# EAGLE design IndividualTrilife_1_3 (EAGLE 6.2)
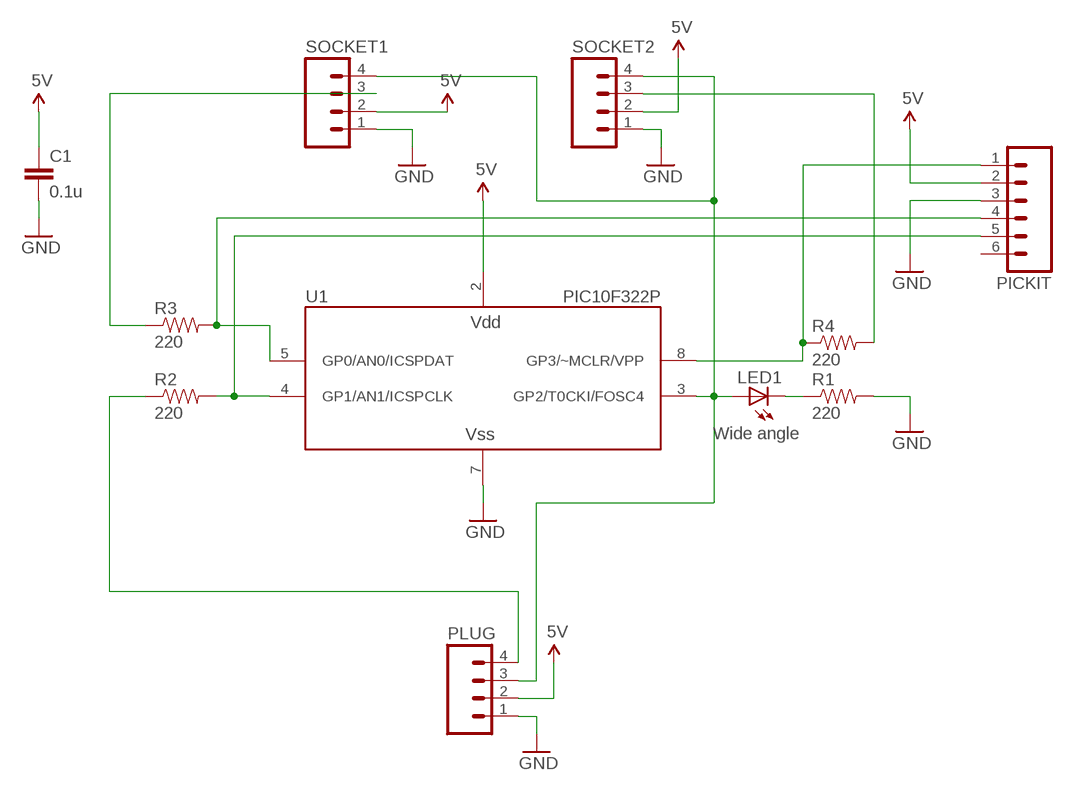
[diagram p0: schematic, sheet 1]

## Parts
C1  0.1u  CAPPTH  [CAP-PTH-SMALL]
LED1  Wide angle  LED5MM  [LED5MM]
PICKIT  M06LOCK  [1X06_LOCK]
PLUG  M04LOCK  [1X04_LOCK]
R1  220  RESISTORPTH-1/4W  [AXIAL-0.4]
R2  220  RESISTORPTH-1/4W  [AXIAL-0.4]
R3  220  RESISTORPTH-1/4W  [AXIAL-0.4]
R4  220  RESISTORPTH-1/4W  [AXIAL-0.4]
SOCKET1  M04LOCK  [1X04_LOCK]
SOCKET2  M04LOCK  [1X04_LOCK]
U1  PIC10F322P  [DIP-8]

## Nets
5V: C1.1 PICKIT.2 PLUG.2 SOCKET1.2 SOCKET2.2 U1.2(VDD)
GND: C1.2 PICKIT.3 PLUG.1 R1.P$2 SOCKET1.1 SOCKET2.1 U1.7(VSS)
N$1: LED1.A PLUG.3 SOCKET1.4 SOCKET2.4 U1.3(GP2/T0CKI/FOSC4)
N$2: LED1.K(C) R1.P$1
N$3: PICKIT.1 R4.P$1 U1.8(GP3/~MCLR/VPP)
N$4: PICKIT.4 R3.P$2 U1.5(GP0/AN0/ICSPDAT)
N$5: PICKIT.5 R2.P$2 U1.4(GP1/AN1/ICSPCLK)
N$6: R4.P$2 SOCKET2.3
N$8: R3.P$1 SOCKET1.3
N$9: PLUG.4 R2.P$1
Unconnected: PICKIT.6

## Library data of the parts
C1 = SparkFun:CAP: Capacitor Standard 0603 ceramic capacitor, and 0.1" leaded capacitor.
LED1 = SparkFun:LED: LEDs Standard schematic elements and footprints for 5mm, 3mm, 1206, and 0603 sized LEDs. 5mm - Spark Fun Electronics SKU : COM-00529 (and others)
PICKIT = SparkFun:M06: Header 6 Standard 6-pin 0.1" header. Use with straight break away headers (SKU : PRT-00116), right angle break away headers (PRT-00553), swiss pins (PRT-00743), machine pins (PRT-00117), and female headers (PRT-00115). Molex polarized connector foot print use with SKU : PRT-08094 with associated crimp pins and housings. NOTES ON THE VARIANTS LOCK and LOCK_LONGPADS... This footprint was designed to help hold the alignment of a through-hole component (i.e. 6-pin header) while soldering it into place. You may notice that each hole has been shifted either up or down by 0.005 of an inch from it's more standard position (which is a perfectly straight line). This slight alteration caused the pins (the squares in the middle) to touch the edges of the holes. Because they are alternating, it causes a "brace" to hold the component in place. 0.005 has proven to be the perfect amount of "off-center" position when using our standard breakaway headers. Although looks a little odd when you look at the bare footprint, once you have a header in there, the alteration is very hard to notice. Also, if you push a header all the way into place, it is covered up entirely on the bottom side. This idea of altering the position of holes to aid alignment will be further integrated into the Sparkfun Library for other footprints. It can help hold any component with 3 or more connection pins.
PLUG SOCKET1 SOCKET2 = SparkFun:M04: Header 4 Standard 4-pin 0.1" header. Use with straight break away headers (SKU : PRT-00116), right angle break away headers (PRT-00553), swiss pins (PRT-00743), machine pins (PRT-00117), and female headers (PRT-00115). Molex polarized connector foot print use with SKU : PRT-08231 with associated crimp pins and housings. 1MM SMD Version SKU: PRT-10208
R1-R4 = SparkFun:RESISTOR: Resistor Basic schematic elements and footprints for 0603, 1206, and PTH resistors.
U1 = CindysStuff:PIC10F32*: Microchip PIC10F320 and 322 6-pin 8-bit Flash microcontroller 4 I/O, 2 8-bit timers, temperature sensor on PIC10F322

## Board
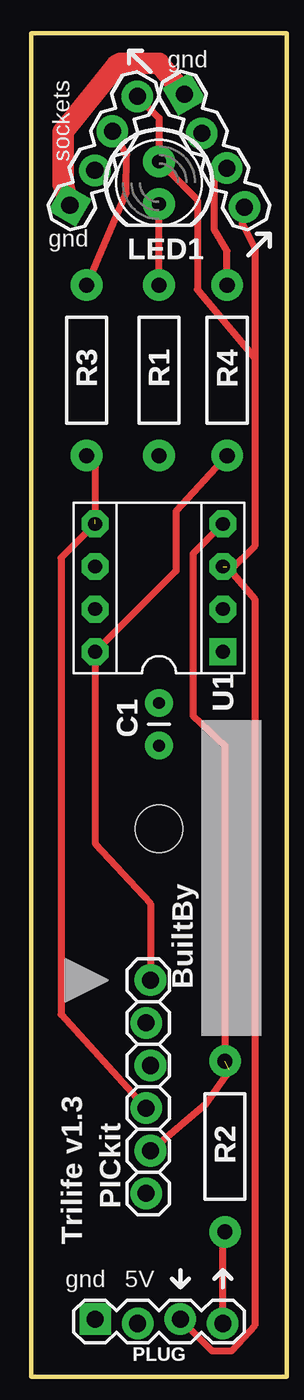
[diagram p1: board, top side]
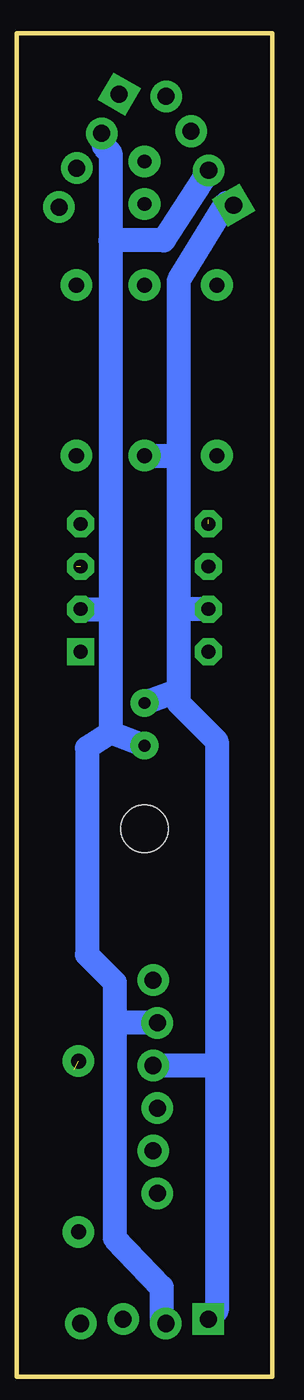
[diagram p2: board, bottom side, seen from below]

No outline drawn. Coordinates in mm, seen from the top.
Copper layers (1*16): Top 0.035mm / dielectric 1.5mm / Bottom 0.035mm
Design rules: minimum track width 10mil, minimum drill 24mil, track to track 8mil, track to pad 8mil, pad to pad 8mil, via to via 8mil, smd to smd 8mil, copper to edge 40mil, drill to drill 8mil, minimum pad ring 10mil, minimum via ring 8mil, stop-mask expansion 4mil, vias tented up to drill 0mil, thermal gap 10mil
Holes 2.8 mm at 7.62,32
Milling: 4 lines

### Footprints (pad centres in the part's own frame; a part is rotated, then mirrored left to right if it is on the bottom)
CAP-PTH-SMALL = drill 0.7 pad 1.651: 1 0,0; 2 2.54,0
LED5MM = drill 0.813 pad 1.88: A -1.27,0; K 1.27,0
1X06_LOCK = drill 1.016 pad 1.88: 1 0,0; 2 2.54,-0.254; 3 5.08,0; 4 7.62,-0.254; 5 10.16,0; 6 12.7,-0.254
1X04_LOCK = drill 1.016 pad 1.88 square: 1 0,0.127 | drill 1.016 pad 1.88: 2 2.54,-0.127; 3 5.08,0.127; 4 7.62,-0.127
AXIAL-0.4 = drill 0.9 pad 1.88: P$1 -5.08,0; P$2 5.08,0
DIP-8 = drill 0.813 pad 1.6 square: 1 -3.81,3.81 | drill 0.813 pad 1.6 octagon: 2 -3.81,1.27; 3 -3.81,-1.27; 4 -3.81,-3.81; 5 3.81,-3.81; 6 3.81,-1.27; 7 3.81,1.27; 8 3.81,3.81

### Placement (x,y rotation side)
C1  7.62,36.96 90 top
LED1  7.62,70.48 270 top
PICKIT  7.11,22.99 270 top
PLUG  3.81,2.67 0 top
R1  7.62,59.31 270 top
R2  11.56,13.08 90 top
R3  3.3,59.31 270 top
R4  11.68,59.31 90 top
SOCKET1  2.41,69.09 60 top
SOCKET2  9.02,75.69 300 top
U1  7.62,46.35 180 top

### Tracks (layer width: path | path; a pad name or v marks a point on that pad's centre or on a via)
5V
  Bottom 1.422: SOCKET2.2 10.05,72.66 9.65,72.26 9.65,67.06 | 9.65,67.06 9.65,45.09 | 9.65,45.09 9.65,37.72 | SOCKET1.2 6.48,67.06 9.65,67.06 | U1.2 9.65,45.09 | C1.1 9.65,37.72 | 9.65,37.72 11.05,36.83 11.05,24.51 9.4,22.86 9.4,20.45 | 9.4,20.45 9.4,7.62 6.6,4.7 6.6,2.79 PLUG.2 | PICKIT.2 9.4,20.45
GND
  Top 1.27: SOCKET1.1 1.91,70.36 1.91,73.53 5.08,77.47 5.33,77.6 7.62,77.6 SOCKET2.1
  Bottom 1.422: SOCKET1.1 2.73,69.28 5.59,64.64 5.59,54.23 | 5.59,54.23 5.59,45.09 | 5.59,45.09 5.59,40.26 | U1.7 5.59,45.09 | R1.P$2 5.59,54.23 | C1.2 5.59,40.26 | 5.59,40.26 5.59,39.5 3.3,37.21 3.3,17.91 | 3.3,17.91 3.3,3.3 PLUG.1 | PICKIT.3 3.3,17.91
N$1  (1 unrouted)
  Top 0.406: SOCKET2.4 12.59,68.06 13.34,66.55 13.34,60.07 | 13.34,60.07 13.34,48.83 11.89,47.39 | 13.34,60.07 9.91,64.14 9.91,69.47 LED1.A 7.62,74.34 SOCKET1.4 | 11.68,47.62 11.89,47.39 | 11.89,47.39 13.34,45.72 13.34,2.41 11.94,0.89 10.79,0.89 PLUG.3
N$2
  Top 0.406: R1.P$1 LED1.K
N$3
  Top 0.406: R4.P$1 8.64,50.93 8.64,47.37 U1.8 3.81,31.11 7.11,27.56 PICKIT.1
N$4  (1 unrouted)
  Top 0.406: PICKIT.4 1.78,20.95 1.78,48.13 U1.5 | R3.P$2 3.81,53.72 3.81,50.42 4.06,50.16
N$5  (1 unrouted)
  Top 0.406: 11.81,17.65 11.68,17.4 10.41,15.62 PICKIT.5 | U1.4 9.65,48.39 9.65,38.73 11.56,36.96 R2.P$2
N$6
  Top 0.406: R4.P$2 11.68,66.42 10.92,67.69 10.92,70.61 SOCKET2.3
N$8
  Top 0.406: R3.P$1 5.66,69.88 5.69,72.16 SOCKET1.3
N$9
  Top 0.406: PLUG.4 11.43,7.87 R2.P$1

### Text on the board
tPlace: gnd | sockets | gnd | LED1 | R3 | R1 | R4 | U1 | C1 | BuiltBy | R2 | PICkit | Trilife v1.3 | gnd | 5V | PLUG